# EAGLE design rl_energy_board (EAGLE 9.5.1)
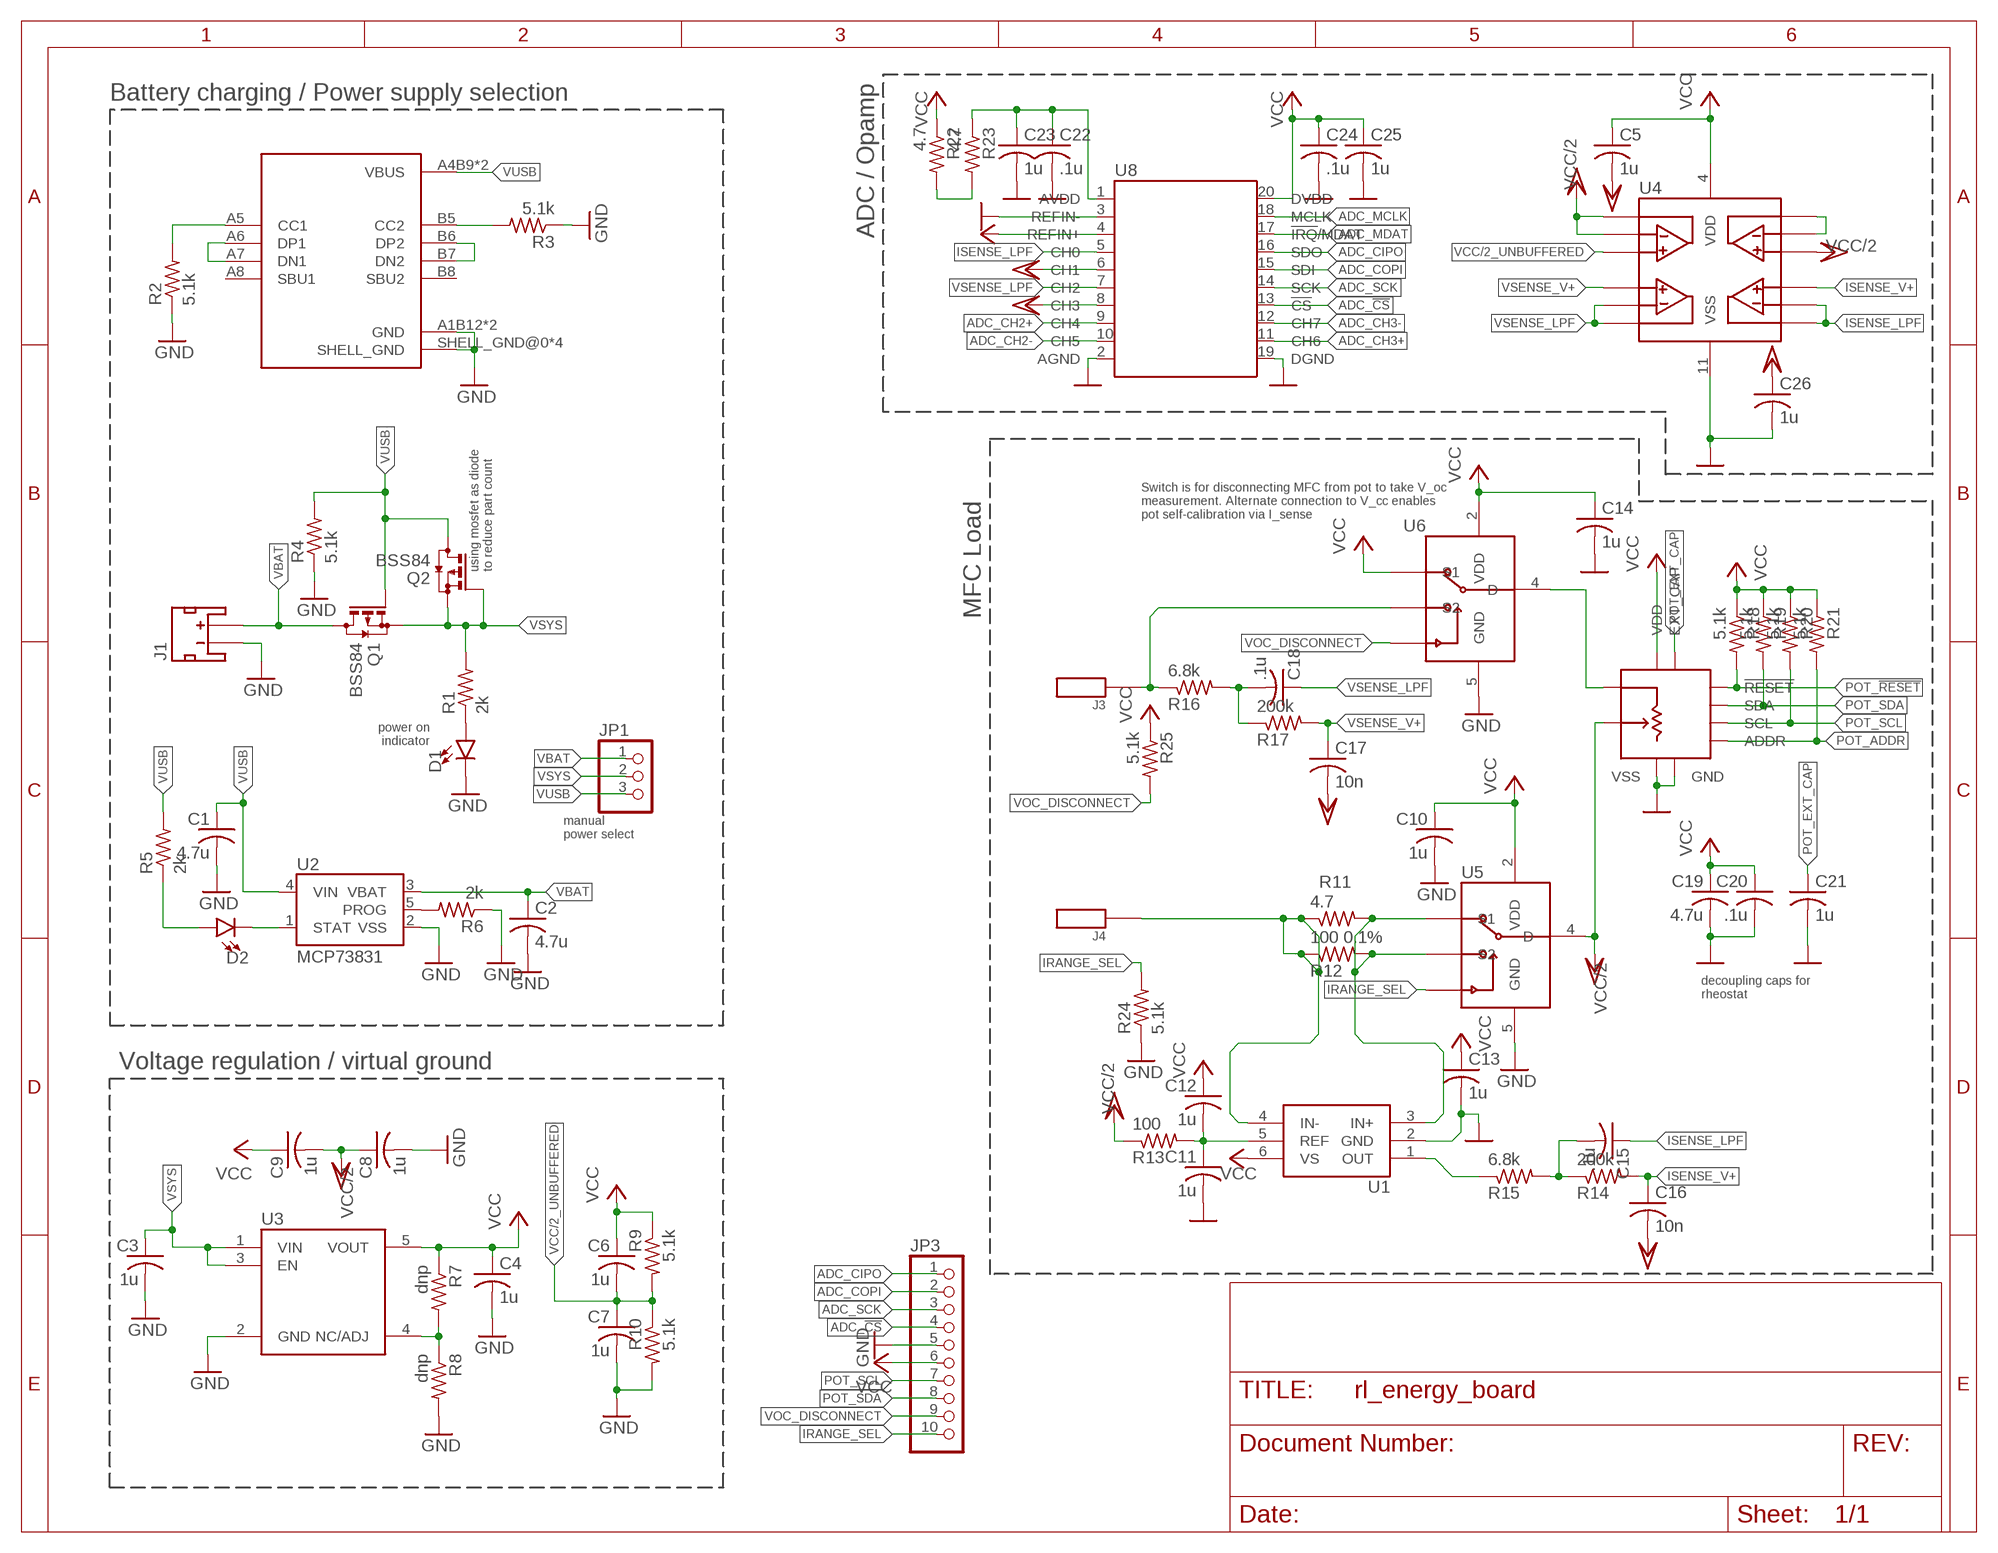
[diagram p0: schematic, sheet 1]

## Parts
C1  4.7u  C-USC0603  [C0603]
C2  4.7u  C-USC0603  [C0603]
C3  1u  C-USC0603  [C0603]
C4  1u  C-USC0603  [C0603]
C5  1u  C-USC0603  [C0603]
C6  1u  C-USC0603  [C0603]
C7  1u  C-USC0603  [C0603]
C8  1u  C-USC0603  [C0603]
C9  1u  C-USC0603  [C0603]
C10  1u  C-USC0603  [C0603]
C11  1u  C-USC0603  [C0603]
C12  1u  C-USC0603  [C0603]
C13  1u  C-USC0603  [C0603]
C14  1u  C-USC0603  [C0603]
C15  .1u  C-USC0603  [C0603]
C16  10n  C-USC0603  [C0603]
C17  10n  C-USC0603  [C0603]
C18  .1u  C-USC0603  [C0603]
C19  4.7u  C-USC0603  [C0603]
C20  .1u  C-USC0603  [C0603]
C21  1u  C-USC0603  [C0603]
C22  .1u  C-USC0603  [C0603]
C23  1u  C-USC0603  [C0603]
C24  .1u  C-USC0603  [C0603]
C25  1u  C-USC0603  [C0603]
C26  1u  C-USC0603  [C0603]
D1  LED0603  [LED-0603]
D2  LED0603  [LED-0603]
J1  JST_2MM_MALE  [JST-2-SMD]
J2  USB4105  [USB4105]
J3  CT3151V1-X  [CT3151V1]
J4  CT3151V1-X  [CT3151V1]
JP1  PINHD-1X3  [1X03]
JP3  PINHD-1X10  [1X10]
Q1  BSS84  [SOT23]
Q2  BSS84  [SOT23]
R1  2k  R-US_R0603  [R0603]
R2  5.1k  R-US_R0603  [R0603]
R3  5.1k  R-US_R0603  [R0603]
R4  5.1k  R-US_R0603  [R0603]
R5  2k  R-US_R0603  [R0603]
R6  2k  R-US_R0603  [R0603]
R7  dnp  R-US_R0603  [R0603]
R8  dnp  R-US_R0603  [R0603]
R9  5.1k  R-US_R0603  [R0603]
R10  5.1k  R-US_R0603  [R0603]
R11  4.7  R-US_R0603  [R0603]
R12  100 0.1%  R-US_R0603  [R0603]
R13  100  R-US_R0603  [R0603]
R14  200k  R-US_R0603  [R0603]
R15  6.8k  R-US_R0603  [R0603]
R16  6.8k  R-US_R0603  [R0603]
R17  200k  R-US_R0603  [R0603]
R18  5.1k  R-US_R0603  [R0603]
R19  5.1k  R-US_R0603  [R0603]
R20  5.1k  R-US_R0603  [R0603]
R21  5.1k  R-US_R0603  [R0603]
R22  4.7  R-US_R0603  [R0603]
R23  4.7  R-US_R0603  [R0603]
R24  5.1k  R-US_R0603  [R0603]
R25  5.1k  R-US_R0603  [R0603]
U1  INA181  [SOT95P280X145-6N]
U2  MCP73831  [SOT23-5]
U3  AP7366  [SOT95P285X130-5N]
U4  MCP6074  [SOP65P640X120-14N]
U5  TMUX1247  [SOT65P210X110-6N]
U6  TMUX1247  [SOT65P210X110-6N]
U7  AD5272BRMZ-XXX  [SOP50P490X95-10N]
U8  MCP3564  [SOP65P640X120-20N]

## Nets
ADC_!CS!: JP3.4 U8.13(!CS)
ADC_CH2+: U8.9(CH4)
ADC_CH2-: U8.10(CH5)
ADC_CH3+: U8.11(CH6)
ADC_CH3-: U8.12(CH7)
ADC_CIPO: JP3.1 U8.16(SDO)
ADC_COPI: JP3.2 U8.15(SDI)
ADC_MCLK: U8.18(MCLK)
ADC_MDAT: U8.17(!IRQ!/MDAT)
ADC_SCK: JP3.3 U8.14(SCK)
GND: C1.2 C2.2 C3.2 C4.2 C7.2 C8.2 C10.2 C11.2 C13.2 C14.2 C19.2 C20.2 C21.2 C22.2 C23.2 C24.2 C25.2 C26.2 D1.C J1.1(-) J2.A1B12(GND) J2.B1A12(GND) J2.SHELL_GND@0(SHELL_GND) J2.SHELL_GND@1(SHELL_GND) J2.SHELL_GND@2(SHELL_GND) J2.SHELL_GND@3(SHELL_GND) JP3.5 R2.1 R3.1 R4.1 R6.1 R8.2 R10.2 R24.1 U1.2(GND) U2.2(VSS) U3.2(GND) U4.11(VSS) U5.5(GND) U6.5(GND) U7.4(VSS) U7.6(GND) U8.2(AGND) U8.3(REFIN-) U8.19(DGND)
IRANGE_SEL: JP3.10 R24.2 U5.6(SEL)
ISENSE_LPF: C15.1 U4.8 U4.9 U8.5(CH0)
ISENSE_V+: C16.1 R14.2 U4.10
MFC+: J3.MNT@0 J3.MNT@1 J3.MNT@2 J3.MNT@3 R16.1 U6.1(S2)
MFC-: J4.MNT@0 J4.MNT@1 J4.MNT@2 J4.MNT@3 R11.1 R12.1 U1.4(IN-)
N$1: D1.A R1.1
N$2: D2.C U2.1(STAT)
N$3: R6.2 U2.5(PROG)
N$4: J2.B6(DP2) J2.B7(DN2)
N$5: J2.A6(DP1) J2.A7(DN1)
N$6: J2.A5(CC1) R2.2
N$7: J2.B5(CC2) R3.2
N$8: D2.A R5.1
N$9: R11.2 R12.2 U1.3(IN+) U5.1(S2) U5.3(S1)
N$10: R7.2 R8.1 U3.4(NC/ADJ)
N$11: R15.1 U1.1(OUT)
N$12: C11.1 C12.2 R13.2 U1.5(REF)
N$13: U6.4(D) U7.2(A)
N$14: C22.1 C23.1 R23.1 U8.1(AVDD)
N$15: R22.2 R23.2
N$16: U4.13 U4.14
N$17: C15.2 R14.1 R15.2
N$18: C18.2 R16.2 R17.1
POT_!RESET: R18.2 U7.7(!RESET)
POT_ADDR: R21.2 U7.10(ADDR)
POT_EXT_CAP: C21.1 U7.5(EXT_CAP)
POT_SCL: JP3.7 R20.2 U7.9(SCL)
POT_SDA: JP3.8 R19.2 U7.8(SDA)
VBAT: C2.1 J1.2(+) JP1.1 Q1.3(D) U2.3(VBAT)
VCC: C4.1 C5.1 C6.1 C9.1 C10.1 C12.1 C13.1 C14.1 C19.1 C20.1 C24.1 C25.1 JP3.6 R7.1 R9.1 R18.1 R19.1 R20.1 R21.1 R22.1 R25.1 U1.6(VS) U3.5(VOUT) U4.4(VDD) U5.2(VDD) U6.2(VDD) U6.3(S1) U7.1(VDD) U8.4(REFIN+) U8.20(DVDD)
VCC/2: C5.2 C8.1 C9.2 C16.2 C17.2 C26.1 R13.1 U4.1 U4.2 U4.12 U5.4(D) U7.3(W) U8.6(CH1) U8.8(CH3)
VCC/2_UNBUFFERED: C6.2 C7.1 R9.2 R10.1 U4.3
VOC_DISCONNECT: JP3.9 R25.2 U6.6(SEL)
VSENSE_LPF: C18.1 U4.6 U4.7 U8.7(CH2)
VSENSE_V+: C17.1 R17.2 U4.5
VSYS: C3.1 JP1.2 Q1.2(S) Q2.1(G) Q2.2(S) R1.2 U3.1(VIN) U3.3(EN)
VUSB: C1.1 J2.A4B9(VBUS) J2.B4A9(VBUS) JP1.3 Q1.1(G) Q2.3(D) R4.2 R5.2 U2.4(VIN)
Unconnected: J1.NC1(PAD1) J1.NC2(PAD2) J2.A8(SBU1) J2.B8(SBU2)

## Notes on the sheet
- ADC / Opamp
- Battery charging / Power supply selection
- MFC Load
- Switch is for disconnecting MFC from pot to take V_oc
  measurement. Alternate connection to V_cc enables 
  pot self-calibration via I_sense
- using mosfet as diode
  to reduce part count
- power on
  indicator
- manual
  power select
- decoupling caps for 
  rheostat
- Voltage regulation / virtual ground

## Library data of the parts
C1-C26 = rcl:C-US: CAPACITOR, American symbol; SPICEPREFIX: C
D1 D2 = SparkFun-LED:LED: LED (Generic) Standard schematic elements and footprints for 5mm, 3mm, 1206, and 0603 sized LEDs. Generic LEDs with no color specified.; MFR: Lite-On Inc.; MFR_PN: LTST-C191KRKT
J1 = SparkFun-Connectors:JST_2MM_MALE: JST 2MM MALE RA CONNECTOR Two pin, compact surface mount connector. Commonly used as a battery input connection point. We really like the solid locking feeling and high current rating on these small connectors. We use these all the time as battery connectors. Mates to single-cell LiPo batteries. Here is the connector we sell at SparkFun: JST Right Angle Connector - White <https://www.sparkfun.com/products/8612> (PRT-08612) Datasheet <http://www.sparkfun.com/datasheets/Prototyping/Connectors/JST-Horizontal.pdf> It was used on these SparkFun products: SparkFun MOSFET Power Controller <https://www.sparkfun.com/products/11214> (PRT-11214) SparkFun Battery Babysitter - LiPo Battery Manager <https://www.sparkfun.com/products/13777> (PRT-13777) And many, many others that required a lipo battery connection.; MFR: JST; MFR_PN: S2B-PH-SM4-TB(LF)(SN); PROD_ID: CONN-11443; SF_ID: PRT-08612
J2 = usb4105:USB4105
J3 J4 = ct3151v1:CT3151V1-X: A vertically-oriented through hole banana plug. Part numbers are of the form CT3151V1-x, where x can be [0-9] and determines color.
JP1 = pinhead:PINHD-1X3: PIN HEADER
JP3 = pinhead:PINHD-1X10: PIN HEADER
Q1 Q2 = transistor-small-signal:BSS84: P-CHANNEL MOS FET
R1-R25 = rcl:R-US_: RESISTOR, American symbol; SPICEPREFIX: R
U1 = ina181:INA181
U2 = SparkFun-IC-Power:MCP73831: MCP73831T Li-Ion, Li-Pol Controller Miniature single cell, fully integrated Li-Ion, Li-polymer charge management controller Datasheet <http://ww1.microchip.com/downloads/en/DeviceDoc/20001984g.pdf> SparkFun Products: SparkFun ESP32 Thing <https://www.sparkfun.com/products/13907> SparkFun 9DoF Razor IMU M0 <https://www.sparkfun.com/products/14001>; PROD_ID: IC-09995
U3 = ap7366:AP7366
U4 = mcp6074:MCP6074
U5 U6 = tmux1247:TMUX1247: Analog SPDT switch IC 3 ohm on-resistance; ~10MOhm off resistance due to leakage current.
U7 = ad5272:AD5272BRMZ-XXX: high-precision i2c digital potentiometer pot / rheostat
U8 = mcp3564:MCP3564

## Board
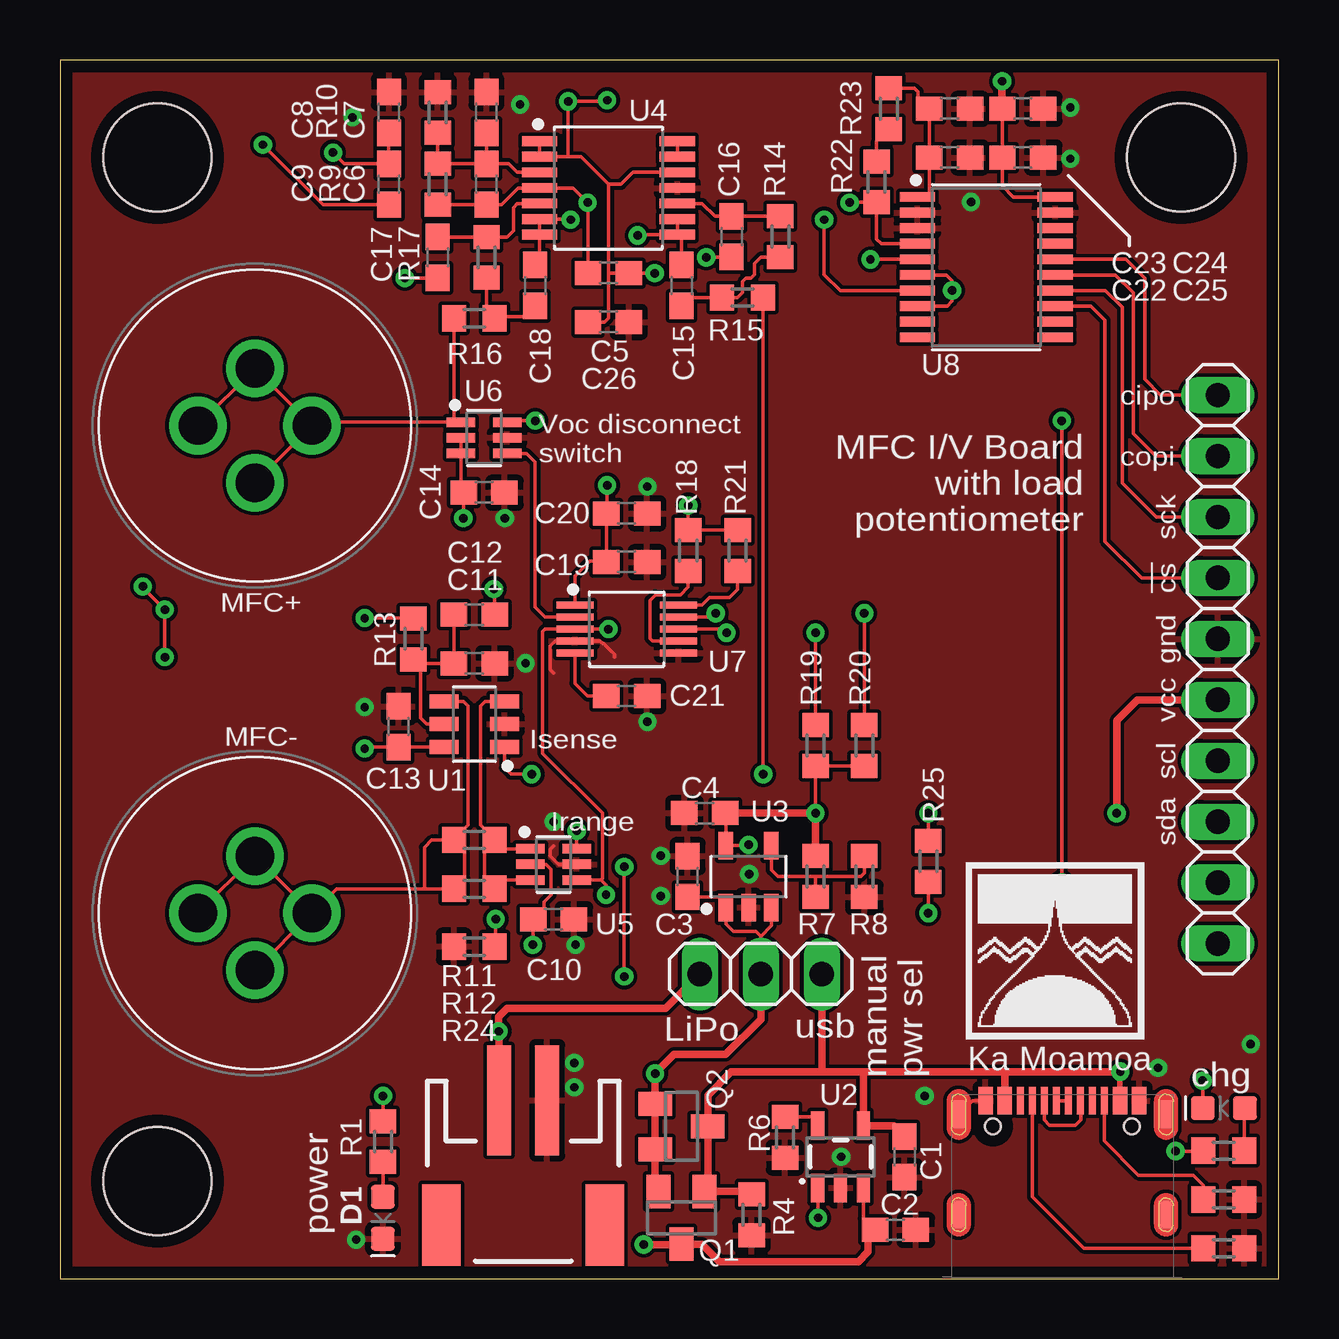
[diagram p1: board, top side]
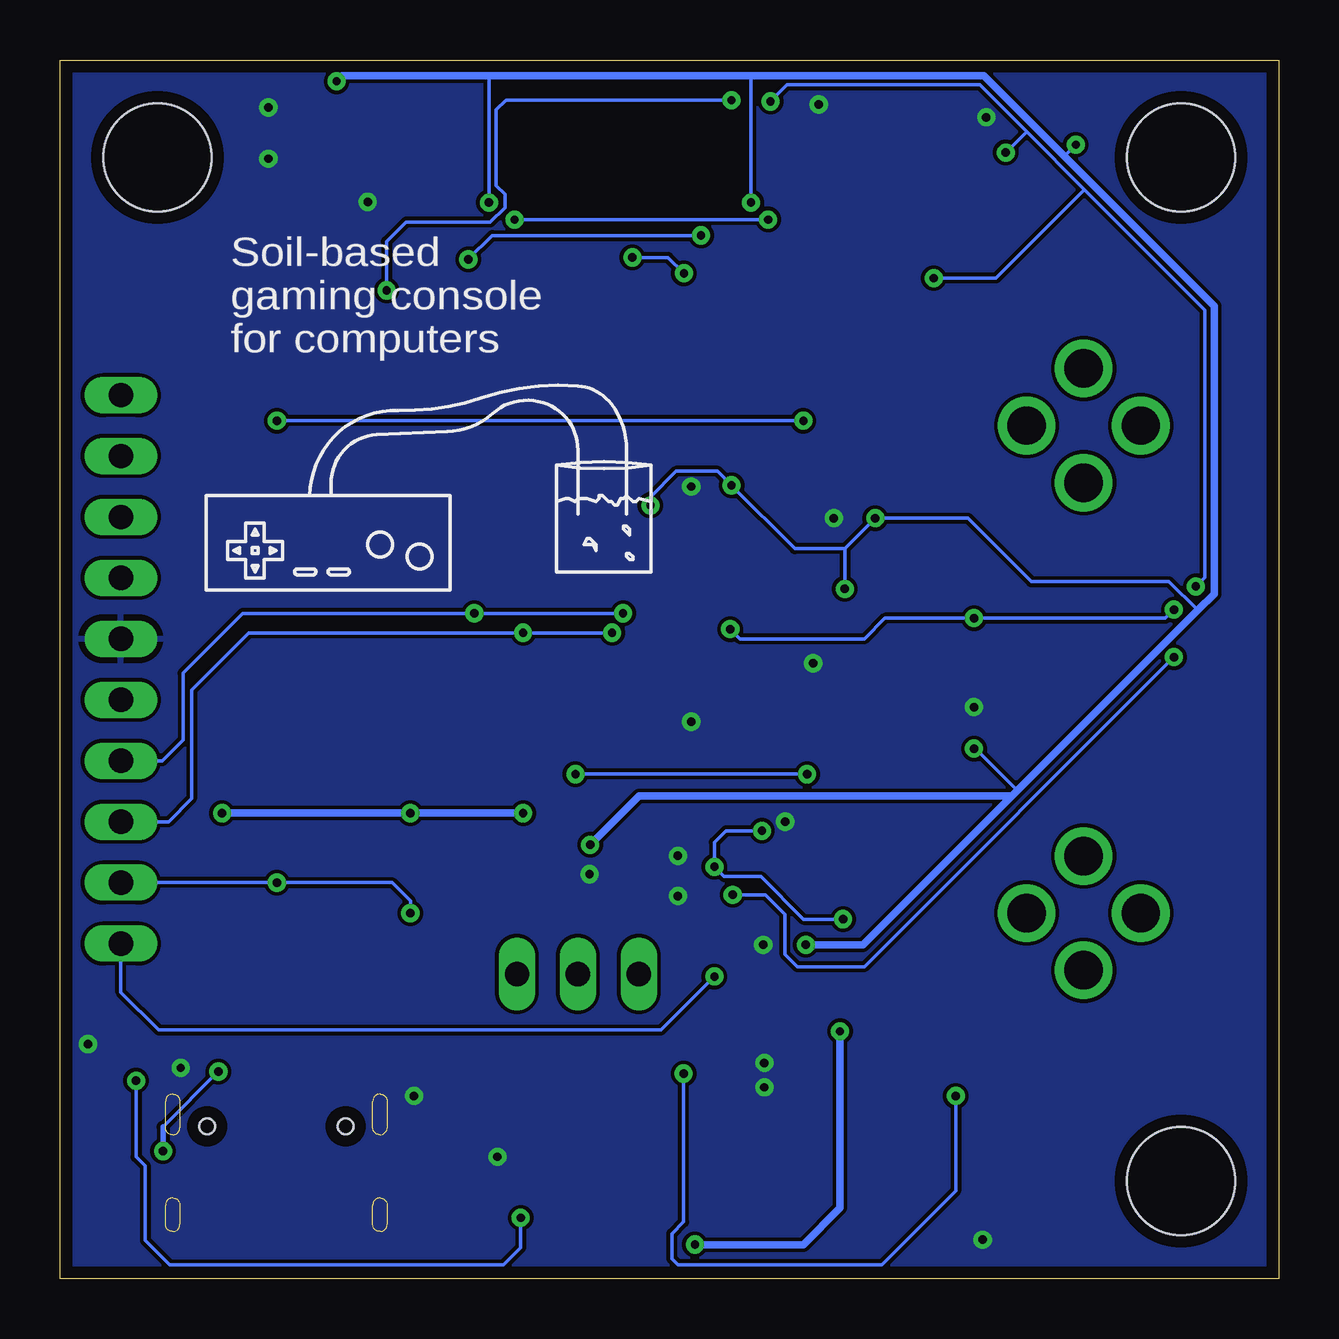
[diagram p2: board, bottom side, seen from below]

Size 50.8 x 50.8 mm. Coordinates in mm from the lower left corner, seen from the top.
Outline: 0,0 50.8,0 50.8,50.8 0,50.8 0,0
Copper layers (1*16): Top 0.035mm / dielectric 1.5mm / Bottom 0.035mm
Design rules "default *": minimum track width 6mil, minimum drill 0.35mm, track to track 6mil, track to pad 6mil, pad to pad 6mil, via to via 6mil, smd to smd 6mil, copper to edge 20mil, drill to drill 6mil, minimum pad ring 10mil, minimum via ring 8mil, stop-mask expansion 4mil, vias tented up to drill 20mil, thermal gap 10mil
Holes 4.5 mm at 4.06,46.74 4.06,4.06 46.74,46.74

### Footprints (pad centres in the part's own frame; a part is rotated, then mirrored left to right if it is on the bottom)
C0603 = smd 1.1 x 1: 1 -0.85,0; 2 0.85,0
LED-0603 = smd 1 x 1: A -0.877,0; C 0.877,0
JST-2-SMD = smd 1 x 4.6: 1 -1,-3.7; 2 1,-3.7 | smd 1.6 x 3.4: NC1 -3.4,1.5; NC2 3.4,1.5
USB4105 = smd 0.6 x 1.15: A1B12 -3.2,4.755; A4B9 -2.4,4.755; B1A12 3.2,4.755; B4A9 2.4,4.755; SHELL_GND@0 -4.3,4.2; SHELL_GND@1 4.3,4.2; SHELL_GND@2 -4.3,0; SHELL_GND@3 4.3,0 | smd 0.3 x 1.15: A5 -1.25,4.755; A6 -0.25,4.755; A7 0.25,4.755; A8 1.25,4.755; B5 1.75,4.755; B6 0.75,4.755; B7 -0.75,4.755; B8 -1.75,4.755 | hole 0.65: -2.89,3.68; 2.89,3.68
CT3151V1 = drill 1.6: MNT@0 -2.38,0; MNT@1 0,2.38; MNT@2 2.38,0; MNT@3 0,-2.38
1X03 = drill 1.016 long: 1 -2.54,0; 2 0,0; 3 2.54,0
1X10 = drill 1.016 long: 1 -11.43,0; 2 -8.89,0; 3 -6.35,0; 4 -3.81,0; 5 -1.27,0; 6 1.27,0; 7 3.81,0; 8 6.35,0; 9 8.89,0; 10 11.43,0
SOT23 = smd 1 x 1.4: 1 -0.95,-1.1; 2 0.95,-1.1; 3 0,1.1
R0603 = smd 1 x 1.1: 1 -0.85,0; 2 0.85,0
SOT95P280X145-6N = smd 1.209 x 0.584: 1 -1.253,0.95; 2 -1.253,0; 3 -1.253,-0.95; 4 1.253,-0.95; 5 1.253,0; 6 1.253,0.95
SOT23-5 = smd 0.55 x 1.2: 1 -0.95,-1.3; 2 0,-1.3; 3 0.95,-1.3; 4 0.95,1.3; 5 -0.95,1.3
SOT95P285X130-5N = smd 1.146 x 0.597: 1 -1.287,0.95; 2 -1.287,0; 3 -1.287,-0.95; 4 1.287,-0.95; 5 1.287,0.95
SOP65P640X120-14N = smd 1.469 x 0.407: 1 -2.871,1.95; 2 -2.871,1.3; 3 -2.871,0.65; 4 -2.871,0; 5 -2.871,-0.65; 6 -2.871,-1.3; 7 -2.871,-1.95; 8 2.871,-1.95; 9 2.871,-1.3; 10 2.871,-0.65; 11 2.871,0; 12 2.871,0.65; 13 2.871,1.3; 14 2.871,1.95
SOT65P210X110-6N = smd 1.186 x 0.397: 1 -0.962,0.65; 2 -0.962,0; 3 -0.962,-0.65; 4 0.962,-0.65; 5 0.962,0; 6 0.962,0.65
SOP50P490X95-10N = smd 1.55 x 0.297: 1 -2.156,1; 2 -2.156,0.5; 3 -2.156,0; 4 -2.156,-0.5; 5 -2.156,-1; 6 2.156,-1; 7 2.156,-0.5; 8 2.156,0; 9 2.156,0.5; 10 2.156,1
SOP65P640X120-20N = smd 1.469 x 0.407: 1 -2.871,2.925; 2 -2.871,2.275; 3 -2.871,1.625; 4 -2.871,0.975; 5 -2.871,0.325; 6 -2.871,-0.325; 7 -2.871,-0.975; 8 -2.871,-1.625; 9 -2.871,-2.275; 10 -2.871,-2.925; 11 2.871,-2.925; 12 2.871,-2.275; 13 2.871,-1.625; 14 2.871,-0.975; 15 2.871,-0.325; 16 2.871,0.325; 17 2.871,0.975; 18 2.871,1.625; 19 2.871,2.275; 20 2.871,2.925

### Placement (x,y rotation side)
C1  35.2,5.08 270 top
C2  34.82,2.03 0 top
C3  26.16,16.76 90 top
C4  26.87,19.41 180 top
C5  22.86,41.91 0 top
C6  17.78,45.62 90 top
C7  17.78,48.62 90 top
C8  13.72,48.62 90 top
C9  13.72,45.62 90 top
C10  20.57,14.99 0 top
C11  17.27,25.65 0 top
C12  17.27,27.69 180 top
C13  14.12,23.01 90 top
C14  17.68,32.77 0 top
C15  25.91,41.4 270 top
C16  27.99,43.43 270 top
C17  15.75,42.57 270 top
C18  19.81,41.4 270 top
C19  23.62,29.87 0 top
C20  23.62,31.9 0 top
C21  23.62,24.28 0 top
C22  37.08,46.74 0 top
C23  37.08,48.77 0 top
C24  40.13,48.77 0 top
C25  40.13,46.74 0 top
C26  22.86,39.88 0 top
D1  13.46,2.54 270 top
D2  48.51,7.11 180 top
J1  19.3,3.73 180 top
J2  41.78,2.67 0 top
J3  8.13,35.56 0 top
J4  8.13,15.24 0 top
JP1  29.21,12.7 0 top
JP3  48.26,25.4 270 top
Q1  25.91,2.54 180 top
Q2  25.91,6.35 270 top
R1  13.46,5.71 90 top
R2  48.51,1.27 180 top
R3  48.51,3.3 180 top
R4  28.83,2.67 90 top
R5  48.51,5.33 180 top
R6  30.23,5.89 90 top
R7  31.5,16.76 270 top
R8  33.53,16.76 270 top
R9  15.75,45.62 90 top
R10  15.75,48.62 90 top
R11  17.27,18.29 0 top
R12  17.27,16.26 0 top
R13  14.73,26.67 270 top
R14  30.02,43.43 90 top
R15  28.45,40.89 180 top
R16  17.27,40.03 0 top
R17  17.78,42.57 90 top
R18  26.19,30.35 270 top
R19  31.5,22.23 90 top
R20  33.53,22.23 90 top
R21  28.24,30.35 270 top
R22  34.04,45.72 90 top
R23  34.54,48.77 270 top
R24  17.27,13.84 0 top
R25  36.2,17.4 270 top
U1  17.27,23.11 180 top
U2  32.54,5.08 0 top
U3  28.7,16.76 90 top
U4  22.86,45.47 0 top
U5  20.57,17.27 0 top
U6  17.68,35.05 0 top
U7  23.62,27.08 0 top
U8  38.61,42.16 0 top

### Tracks (layer width: path | path; a pad name or v marks a point on that pad's centre or on a via)
ADC_!CS!
  Top 0.152: U8.13 42.98,40.54 43.56,39.95 43.56,30.73 45.09,29.21 JP3.4
ADC_CIPO
  Top 0.152: U8.16 44.43,42.49 45.21,41.71 45.21,37.49 45.87,36.83 JP3.1
ADC_COPI
  Top 0.152: U8.15 43.99,41.84 44.73,41.1 44.73,35.23 45.67,34.29 JP3.2
ADC_SCK
  Top 0.152: U8.14 43.57,41.19 44.27,40.49 44.27,33.17 45.7,31.75 JP3.3
GND  (via drill 0.35)
  Top 0.152: J2.A1B12 38.04,7.42 J2.SHELL_GND@0 | U5.5 20.78,17.27 20.43,17.62 20.43,17.63 20.43,17.89 20.57,18.03 | 23.11,25.91 23.11,26.01 22.65,26.47 22.61,26.47 22.5,26.58 U7.4 20.63,26.58 20.42,26.36 20.42,25.4 20.57,25.25
  other vias: 32.56,5.08 12.34,1.63 21.44,8.99 21.44,7.98 21.49,13.92 42.11,46.69 42.11,48.82 18.54,31.7 19.41,25.65 24.49,23.22 24.49,33.02 12.7,23.83 25.04,17.63 20.57,19.05 25.04,15.95 12.19,48.41 19.18,48.95 36.04,7.62 45.77,8.79 37.97,44.88 28.73,16.87 49.63,9.78
  pour Top (rank 3): -1,52.76 52,52.76 52,-1 -1,-1
  pour Bottom (rank 2): -1,52 52,52 52,-1 -1,-1
IRANGE_SEL  (via drill 0.35)
  Top 0.152: v23.52,17.17 v23.52,12.6 | U5.6 v21.54,18.67 | v18.16,14.99 18.16,13.88 R24.2
  Bottom 0.152: JP3.10 48.26,11.94 46.69,10.36 25.76,10.36 v23.52,12.6 | v21.54,18.67 23.04,18.67 23.52,18.19 v23.52,17.17 23.11,16.76 21.59,16.76 19.81,14.99 v18.16,14.99
ISENSE_LPF  (via drill 0.35)
  Top 0.152: U4.9 U4.8 | U4.8 25.91,43.34 C15.1 | U4.8 24.11,43.52 v24.08,43.48 | U8.5 v33.78,42.49
  Bottom 0.152: v33.78,42.49 32.79,43.48 v24.08,43.48
ISENSE_V+
  Top 0.152: U4.10 26.76,44.82 27.29,44.28 C16.1 R14.2
MFC+
  Top 0.152: U6.1 16.46,35.7 | 16.46,35.7 10.65,35.7 10.56,35.62 | 10.56,35.62 J3.MNT@2 J3.MNT@3 | J3.MNT@0 J3.MNT@1 10.45,35.62 10.56,35.62 | R16.1 16.42,35.74 16.46,35.7
MFC-
  Top 0.152: U1.4 16.83,24.06 17.02,23.88 17.02,18.92 16.87,18.77 | 16.87,18.77 16.42,18.33 R11.1 15.49,18.29 15.19,17.98 15.19,16.26 | 16.87,18.77 16.87,16.7 R12.1 15.19,16.26 | J4.MNT@2 11.52,16.26 15.19,16.26 | J4.MNT@0 J4.MNT@1 J4.MNT@2 | J4.MNT@3 J4.MNT@2
N$1
  Top 0.152: D1.A R1.1
N$2  (via drill 0.35)
  Top 0.152: D2.C 47.64,8.24 v47.62,8.26 | v31.6,2.54 31.59,2.55 U2.1
  Bottom 0.152: v47.62,8.26 47.62,5.08 47.24,4.7 47.24,1.6 46.23,0.58 32.31,0.58 31.6,1.29 v31.6,2.54
N$3
  Top 0.152: R6.2 31.61,6.74 31.65,6.71 31.65,6.44 U2.5
N$4
  Top 0.152: J2.B7 41.03,6.62 41.25,6.4 42.32,6.4 42.55,6.63 42.55,7.41 J2.B6
N$5
  Top 0.152: J2.A6 J2.A7
N$6
  Top 0.152: J2.A5 40.53,3.41 42.67,1.27 R2.2
N$7
  Top 0.152: J2.B5 43.53,5.74 44.96,4.32 47.24,4.32 47.66,3.9 R3.2
N$8
  Top 0.152: R5.1 49.36,7.08 D2.A
N$9
  Top 0.152: U1.3 17.71,24.06 17.53,23.88 17.53,18.92 17.69,18.76 | 18.12,18.33 R11.2 | 18.12,18.33 17.69,18.76 | R12.2 17.76,16.62 | 17.69,18.76 17.69,16.69 17.75,16.63 17.76,16.62 | U5.1 18.53,17.92 18.12,18.33 | U5.3 17.76,16.62
N$10
  Top 0.152: U3.4 29.65,17.03 29.92,16.76 31.5,16.76 | R8.1 33.53,16.92 33.38,16.76 31.5,16.76 | R7.2 31.5,16.76
N$11  (via drill 0.35)
  Top 0.152: U1.1 18.52,21.3 18.8,21.03 v19.66,21.03 | R15.1 29.31,40.88 v29.31,21.03
  Bottom 0.152: v19.66,21.03 v29.31,21.03
N$12
  Top 0.152: U1.5 15.29,23.11 15.04,23.37 15.04,25.52 R13.2 14.9,25.65 C11.1 C12.2
N$13
  Top 0.152: U6.4 19.45,34.4 19.81,34.04 19.81,27.99 20.23,27.58 U7.2
N$14
  Top 0.152: 34.7,49.47 R23.1 35.62,49.62 35.76,49.48 35.76,49.24 C23.1 C22.1 36.23,45.17 36.15,45.09 U8.1
N$15
  Top 0.152: R22.2 34.04,47.41 R23.2
N$16
  Top 0.152: U4.14 U4.13
N$17
  Top 0.152: C15.2 26.25,40.89 R15.2 28.25,40.89 28.45,41.1 28.45,41.55 28.6,41.71 28.8,41.71 28.96,41.86 28.96,42.32 29.22,42.58 R14.1
N$18
  Top 0.152: R16.2 18.05,40.1 | 18.05,40.1 17.78,40.37 R17.1 | C18.2 19.36,40.1 18.05,40.1
POT_!RESET
  Top 0.152: U7.7 24.71,26.58 24.59,26.7 24.59,28.27 24.82,28.5 25.86,28.5 26.19,28.83 R18.2
POT_ADDR
  Top 0.152: U7.10 26.76,28.08 27.08,28.4 27.91,28.4 28.25,28.73 R21.2
POT_EXT_CAP
  Top 0.152: U7.5 21.47,24.81 22,24.28 C21.1
POT_SCL  (via drill 0.35)
  Top 0.152: U7.9 27.17,27.58 v27.33,27.74 | R20.2 v33.53,27.74
  Bottom 0.152: JP3.7 46.53,21.59 45.67,22.45 45.67,25.25 43.18,27.74 v33.53,27.74 v27.33,27.74
POT_SDA  (via drill 0.35)
  Top 0.152: U7.8 27.64,27.08 v27.79,26.92 | 48.25,19.04 JP3.8 | R19.2 v31.5,26.92
  Bottom 0.152: v27.79,26.92 v31.5,26.92 42.93,26.92 45.31,24.54 45.31,20.02 46.28,19.05 JP3.8
VBAT  (via drill 0.35)
  Top 0.152: U2.3 33.49,2.52 33.67,2.33 C2.1
  Top 0.305: 33.67,2.33 33.68,2.33 33.68,1.12 33.27,0.71 27.48,0.71 26.75,1.44 Q1.3 25.89,1.42 v24.33,1.42 | J1.2 18.3,10.3 v18.29,10.31 18.29,10.92 18.64,11.28 25.25,11.28 JP1.1
  Bottom 0.305: v24.33,1.42 19.81,1.42 18.29,2.95 v18.29,10.31
VCC  (via drill 0.35)
  Top 0.152: C4.1 27.75,19.38 U3.5 28.67,18.05 v28.7,18.09 | U5.2 20.27,17.27 20.47,17.07 20.47,16 20.17,15.7 20.17,15.34 19.81,14.99 | 19.81,14.99 C10.1 | v19.71,13.92 19.71,14.88 19.81,14.99 | C24.1 C25.1 39.28,45.55 39.75,45.09 U8.20 | U6.2 U6.3 16.72,32.88 C14.1 16.82,32.75 v16.82,31.7 | v22.81,33.07 22.81,31.94 C20.1 22.77,29.92 | C19.1 22.77,29.92 | U7.1 21.47,29.29 22.1,29.92 22.77,29.92 | v18.09,28.75 18.12,28.72 C12.1 | U1.6 C13.1 12.76,22.16 v12.7,22.1 | R9.1 C6.1 18.4,44.77 19.1,45.47 U4.4 21.39,45.47 v22,44.86 22.01,44.84 C5.1 | v32.92,44.86 32.93,44.87 R22.1 34.04,43.33 34.23,43.14 U8.4 | 44.06,20.74 44.04,20.75 | v26.19,32.23 R18.1 R21.1 | v8.46,47.27 10.96,44.77 C9.1 | R19.1 31.62,21.38 | 31.62,21.38 R20.1 | v31.5,19.41 31.5,21.25 31.62,21.38 | R25.1 v36.2,19.41
  Top 0.305: C4.1 v31.5,19.41 R7.1 | v39.27,49.91 39.27,48.78 C24.1 | v44.04,19.41 44.04,20.75 44.04,23.27 44.91,24.13 JP3.6
  Bottom 0.152: 10.9,20.34 12.65,22.1 v12.7,22.1 | 18.09,30.43 v16.82,31.7 12.95,31.7 10.31,29.06 4.57,29.06 3.38,27.86 | 18.09,30.43 v18.09,28.75 | 18.09,30.43 20.17,30.43 v22.81,33.07 23.39,33.66 25.12,33.66 26.19,32.59 v26.19,32.23 | v22,44.86 22,50.14 | v32.92,44.86 32.92,50.09 32.97,50.14 | 8.94,46.79 v8.46,47.27
  Bottom 0.305: v28.7,18.09 26.67,20.12 11.12,20.12 | 11.12,20.12 10.9,20.34 3.38,27.86 2.69,28.55 2.69,40.54 8.94,46.79 12.29,50.14 22,50.14 32.97,50.14 39.04,50.14 v39.27,49.91 | 11.12,20.12 17.32,13.92 v19.71,13.92 | v31.5,19.41 v36.2,19.41 v44.04,19.41
VCC/2  (via drill 0.35)
  Top 0.152: C26.1 22.71,39.88 22.86,40.03 22.86,41.91 | U4.1 U4.2 21.18,46.77 | 21.18,46.77 21.71,46.77 22.86,45.62 | 22.86,45.62 22.86,41.91 | 22.86,41.91 C5.2 v24.79,41.91 | 21.18,46.77 v21.18,49.07 22.76,49.07 v22.81,49.12 | v12.7,27.53 14.72,27.53 R13.1 | v14.38,41.71 15.73,41.71 C17.2 | U8.6 36.95,41.84 37.19,41.6 v37.19,41.2 37.19,40.74 36.98,40.54 U8.8 | v22.86,27.08 U7.3 20.22,27.08 20.12,26.98 20.12,21.89 22.61,19.41 22.61,16.68 22.55,16.62 | v3.45,28.85 3.45,28.8 v4.37,27.89 v4.37,25.91 | U5.4 22.55,16.62 | 22.55,16.62 22.76,16.41 v22.76,16 | C16.2 26.95,42.58 v26.94,42.57 | C8.1 13.69,47.74 13.69,46.49 C9.2 11.85,46.47 v11.38,46.94 | 22.86,45.62 23.39,45.62 23.89,46.12 U4.12
  Bottom 0.152: v21.18,49.07 20.5,49.76 12.45,49.76 10.51,47.81 | 10.51,47.81 8.09,45.4 | 8.09,45.4 3.07,40.38 3.07,29.23 v3.45,28.85 | 8.09,45.4 11.79,41.71 v14.38,41.71 | v22.81,49.12 32.21,49.12 32.61,48.72 32.61,45.57 32.26,45.21 32.26,44.65 32.87,44.04 36.37,44.04 37.19,43.23 v37.19,41.2 | v22.86,27.08 22.45,26.67 17.27,26.67 16.41,27.53 v12.7,27.53 4.72,27.53 v4.37,27.89 | v4.37,25.91 17.27,13.01 20.07,13.01 20.57,13.51 20.57,15.19 21.39,16 v22.76,16 | v24.79,41.91 25.45,42.57 v26.94,42.57 | v11.38,46.94 10.51,47.81
VCC/2_UNBUFFERED
  Top 0.152: C6.2 R9.2 R10.1 | C7.1 C6.2 | U4.3 19.06,46.12 18.69,46.48 17.79,46.48 C6.2
VOC_DISCONNECT  (via drill 0.35)
  Top 0.152: U6.6 18.7,35.76 v19.81,35.76 | v41.76,35.76 v41.76,16.51 | v36.2,15.24 R25.2
  Bottom 0.152: v19.81,35.76 v41.76,35.76 | JP3.9 v41.76,16.51 36.96,16.51 36.2,15.75 v36.2,15.24
VSENSE_LPF  (via drill 0.35)
  Top 0.152: C18.1 19.99,42.43 U4.7 U4.6 21.26,44.17 v21.29,44.15 | v31.85,44.15 31.85,41.86 32.52,41.19 U8.7
  Bottom 0.152: v21.29,44.15 v31.85,44.15
VSENSE_V+
  Top 0.152: C17.1 R17.2 18.63,43.42 18.9,43.69 18.9,44.65 19.06,44.82 U4.5
VSYS  (via drill 0.35)
  Top 0.152: R1.2 v13.46,7.62 | 29.67,15.49 U3.3 29.65,14.72 29.21,14.28 | JP1.2 29.21,14.28 | 26.2,15.95 C3.1 27.65,15.91 27.75,15.81 U3.1 27.75,14.79 28.07,14.48 29.01,14.48 29.21,14.28
  Top 0.305: JP1.2 29.21,10.82 27.74,9.35 25.6,9.35 v24.81,8.55 Q2.1 Q2.2 24.81,3.79 Q1.2
  Bottom 0.152: v13.46,7.62 13.46,3.66 16.54,0.58 25.04,0.58 25.3,0.84 25.3,1.88 24.81,2.37 v24.81,8.55
VUSB  (via drill 0.35)
  Top 0.152: v46.5,5.32 R5.2
  Top 0.229: J2.B4A9 44.18,8.62 v44.2,8.64 | R5.2 | 33.49,6.72 U2.4
  Top 0.305: J2.A4B9 39.38,8.62 | 44.18,8.62 39.38,8.62 | R4.2 28.71,3.64 Q1.1 27.01,3.79 Q2.3 27.01,7.65 27.98,8.62 31.75,8.62 | 31.75,8.62 33.48,8.62 | 33.48,8.62 39.38,8.62 | 33.48,8.62 33.49,8.61 U2.4 34.75,6.38 C1.1 | JP1.3 31.75,8.62
  Bottom 0.152: v44.2,8.64 46.5,6.33
  Bottom 0.229: 46.5,6.33 v46.5,5.32

### Text on the board
tPlace: cipo | MFC I/V Board / with load / potentiometer | Voc disconnect / switch | copi | sck | !cs! | MFC+ | gnd | vcc | MFC- | Isense | scl | Irange | sda | LiPo | usb | Ka Moamoa | chg | manual / pwr sel | power
bPlace: Soil-based / gaming console / for computers